# Altium schematic sheet MCU.SchDoc
size Tabloid; SheetNumber: 2; SheetTotal: 4
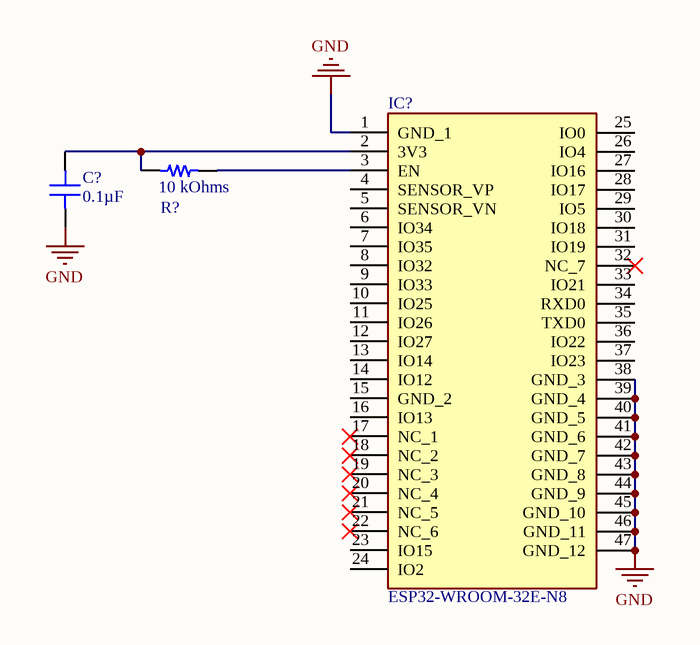
[diagram p0: MCU.SchDoc]

## Parts
C?  0.1µF  [CAP 0603_1608]
IC?  ESP32-WROOM-32E-N8  [ESP32WROOM32EN8]
R?  10 kOhms  [RES 0603_1608]

## Nets
GND: C?.1 IC?.1(GND_1) IC?.38(GND_3) IC?.39(GND_4) IC?.40(GND_5) IC?.41(GND_6) IC?.42(GND_7) IC?.43(GND_8) IC?.44(GND_9) IC?.45(GND_10) IC?.46(GND_11) IC?.47(GND_12)
NetC?_2: C?.2 IC?.2(3V3) R?.1
NetIC?_3: IC?.3(EN) R?.2

Not connected (* = marked no-connect by the designer): IC? 4(SENSOR_VP) 5(SENSOR_VN) 6(IO34) 7(IO35) 8(IO32) 9(IO33) 10(IO25) 11(IO26) 12(IO27) 13(IO14) 14(IO12) 15(GND_2) 16(IO13) 17(NC_1)* 18(NC_2)* 19(NC_3)* 20(NC_4)* 21(NC_5)* 22(NC_6)* 23(IO15) 24(IO2) 25(IO0) 26(IO4) 27(IO16) 28(IO17) 29(IO5) 30(IO18) 31(IO19) 32(NC_7)* 33(IO21) 34(RXD0) 35(TXD0) 36(IO22) 37(IO23)

## Notes on the sheet
- Insert really cool logo here
- Really_Cool_Title:
- Revision:
- Desciption:
- Version:
- Engineer:

## Library data of the parts
C? = 06033G104MAT2A: CAP CER 0.1UF 25V Y5V 0603; manufacturer: AVX Corporation; Temperature Coefficient: Y5V (F); Tolerance: ±20%; Part Number: 06033G104MAT2A; Value: 0.1µF; Applications: General Purpose; Capacitance: 0.1µF; componentlink1description: Datasheet; componentlink1url: http://datasheets.avx.com/Y5V.pdf; componentlink2description: DigiKey Link; componentlink2url: http://digikey.com/product-detail/en/avx-corporation/06033G104MAT2A/478-11369-1-ND/8019122; Device Package: 0603 (1608 Metric); lastupdated: 9/2/2020 1:03:16 AM; Lifecycle Status: Active; Minimum Order: 1; Mounting Type: Surface Mount, MLCC; Operating Temperature: -30°C ~ 85°C; Package / Case: 0603 (1608 Metric); packaging: TapeAndReel; partid: 13439; Part Status: Active; price: 0.02; series: -; Size / Dimension: 0.063" L x 0.032" W (1.60mm x 0.81mm); Supplier 1: DigiKey; Supplier Part Number 1: 478-11369-1-ND; Thickness (Max): 0.035" (0.90mm); Voltage - Rated: 25V
IC? = ESP32-WROOM-32E-N8: Integrated Circuit; Manufacturer_Name: Espressif Systems; Datasheet Link: https://www.google.com/url?sa=t&rct=j&q=&esrc=s&source=web&cd=&ved=2ahUKEwjLw4ysybv2AhXFzIUKHZUbB64QFnoECCwQAQ&url=https%3A%2F%2Fwww.espressif.com%2Fsites%2Fdefault%2Ffiles%2Fdocumentation%2Fesp32-wroom-32e_esp32-wroom-32ue_datasheet_en.pdf&usg=AOvVaw1xSL; Height: 3.25mm; Manufacturer_Part_Number: ESP32-WROOM-32E-N8; Mouser Part Number: 356-ESP32WRM32E164PH; Mouser Price/Stock: https://www.mouser.co.uk/ProductDetail/Espressif-Systems/ESP32-WROOM-32E-N8?qs=Li%252BoUPsLEnsLnZW%252BGLgUhw%3D%3D
R? = CRCW060310K0JNEA: RES SMD 10K OHM 5% 1/10W 0603; Manufacturer: Vishay Dale; Power (Watts): 0.1W, 1/10W; Temperature Coefficient: ±200ppm/°C; Part Number: CRCW060310K0JNEA; Value: 10 kOhms; ComponentLink1Description: Datasheet; ComponentLink1URL: http://www.vishay.com/docs/20035/dcrcwe3.pdf; ComponentLink2Description: DigiKey Link; ComponentLink2URL: https://www.digikey.com/en/products/detail/vishay-dale/CRCW060310K0JNEA/1174253; Composition: Thick Film; Device Package: 0603 (1608 Metric); Features: Automotive AEC-Q200; Height - Seated (Max): 0.020" (0.50mm); LastUpdated: 2/9/2024 8:43:35 PM; Lifecycle Status: Active; Minimum Order: 1; Number of Terminations: 2; Operating Temperature: -55°C ~ 155°C; Package / Case: 0603 (1608 Metric); Packaging: CutTape; PartId: 5216; Part Status: Active; Price: 0.01; Ratings: AEC-Q200; Resistance: 10 kOhms; Series: CRCW; Size / Dimension: 0.063" L x 0.033" W (1.60mm x 0.85mm); Supplier 1: DigiKey; Supplier Part Number 1: 541-10KGCT-ND; Supplier Device Package: 0603; Tolerance: ±5%